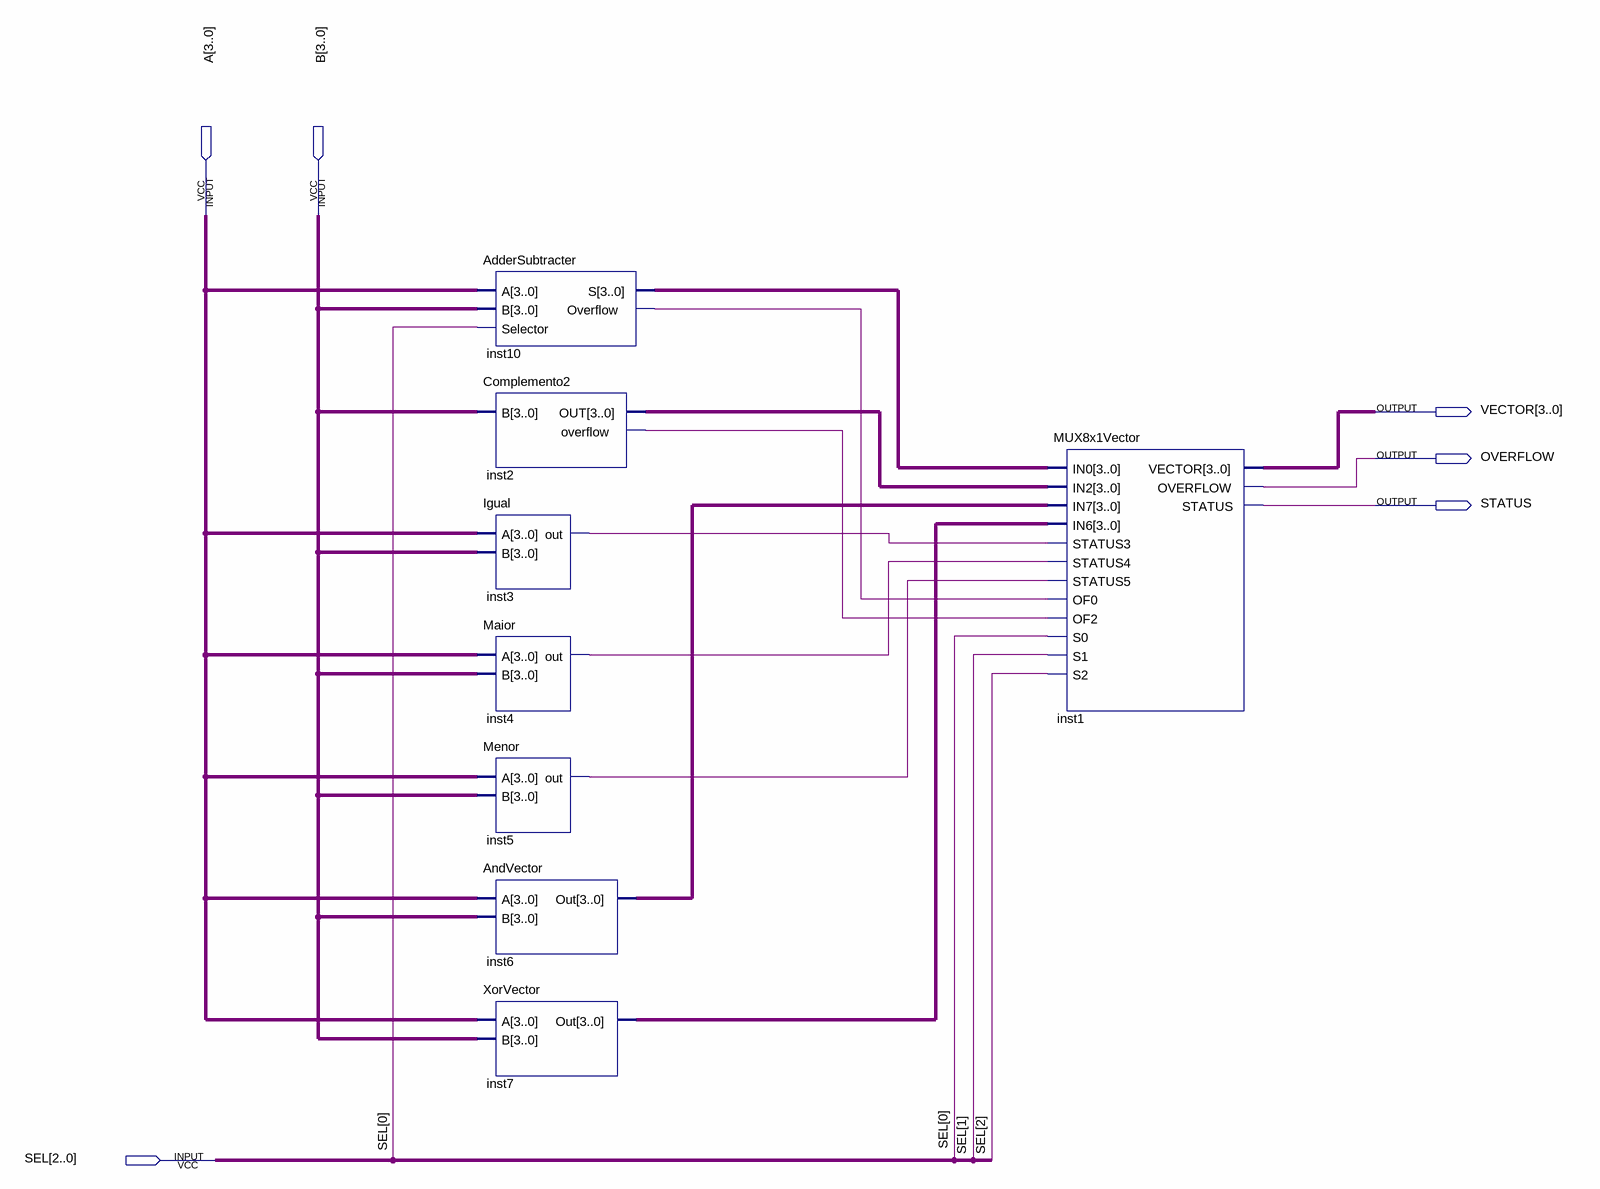
[diagram p0: schematic sheet]
// Quartus schematic OPERACOES.bdf as structural Verilog: 8 symbols, 6 pins
module OPERACOES (
  input  [3:0] A,
  input  [3:0] B,
  input  [2:0] SEL,
  output [3:0] VECTOR,
  output OVERFLOW,
  output STATUS
);

  wire inst2_overflow, inst3_out, inst4_out, inst5_out, inst10_overflow;
  wire [3:0] inst2_out, inst6_out, inst7_out, inst10_s;

  AdderSubtracter inst10 (.A(A), .B(B), .Selector(SEL[0]), .Overflow(inst10_overflow), .S(inst10_s));
  Complemento2 inst2 (.B(B), .OUT(inst2_out), .overflow(inst2_overflow));
  Igual inst3 (.A(A), .B(B), .out(inst3_out));
  Maior inst4 (.A(A), .B(B), .out(inst4_out));
  Menor inst5 (.A(A), .B(B), .out(inst5_out));
  AndVector inst6 (.A(A), .B(B), .Out(inst6_out));
  XorVector inst7 (.A(A), .B(B), .Out(inst7_out));
  MUX8x1Vector inst1 (
    .IN0(inst10_s), .IN2(inst2_out), .IN7(inst6_out), .IN6(inst7_out), .STATUS3(inst3_out),
    .STATUS4(inst4_out), .STATUS5(inst5_out), .OF0(inst10_overflow), .OF2(inst2_overflow), .S0(SEL[0]),
    .S1(SEL[1]), .S2(SEL[2]), .VECTOR(VECTOR), .OVERFLOW(OVERFLOW), .STATUS(STATUS));
endmodule
